# EAGLE design sigma_delta_v1_0 (EAGLE 6.5.0)
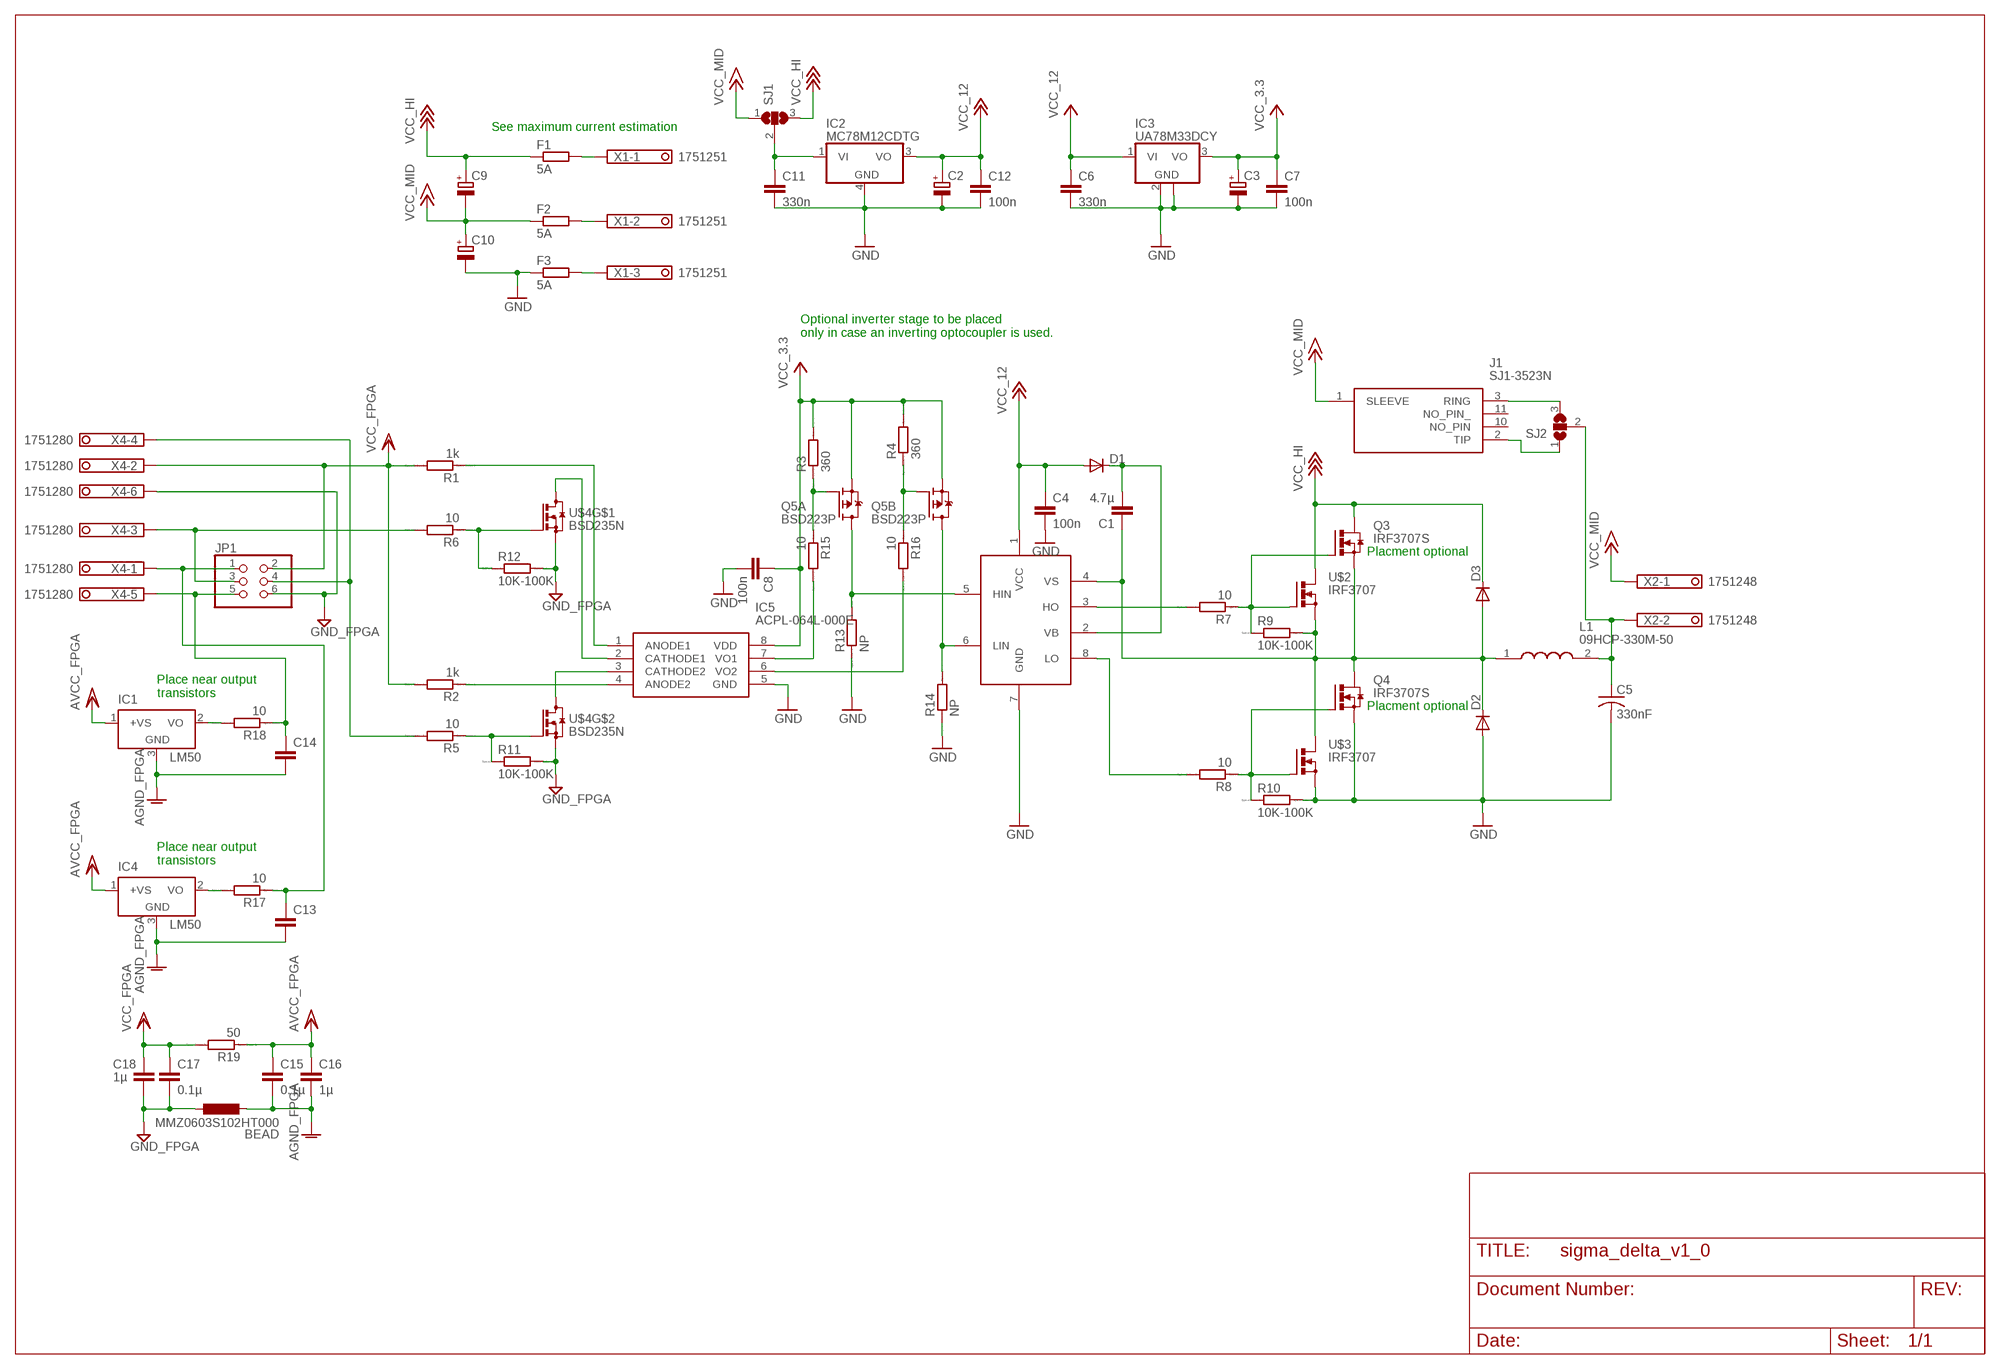
[diagram p0: schematic, sheet 1]

## Parts
BEAD  MMZ0603S102HT000  L-EUL2012C  [L2012C]
C1  4.7µ  C-EUC0805K  [C0805K]
C2  CPOL-EUUD-6,3X7,7  [UD-6,3X7,7_NICHICON]
C3  CPOL-EUUD-6,3X7,7  [UD-6,3X7,7_NICHICON]
C4  100n  C-EUC0805  [C0805]
C5  330nF  C-USC2220K  [C2220K]
C6  330n  C-EUC0603  [C0603]
C7  100n  C-EUC0603  [C0603]
C8  100n  C-EUC0603  [C0603]
C9  CPOL-EUUD-10X10  [UD-10X10_NICHICON]
C10  CPOL-EUUD-10X10  [UD-10X10_NICHICON]
C11  330n  C-EUC0603  [C0603]
C12  100n  C-EUC0603  [C0603]
C13  C-EUC0603  [C0603]
C14  C-EUC0603  [C0603]
C15  0.1µ  C-EUC0603  [C0603]
C16  1µ  C-EUC0603  [C0603]
C17  0.1µ  C-EUC0603  [C0603]
C18  1µ  C-EUC0603  [C0603]
D1  DIODE-DO214AC  [DO214AC]
D2  DIODE-DO214AC  [DO214AC]
D3  DIODE-DO214AC  [DO214AC]
F1  5A  R-EU_M1206  [M1206]
F2  5A  R-EU_M1206  [M1206]
F3  5A  R-EU_M1206  [M1206]
IC1  LM50  [SOT23]
IC2  MC78M12CDTG  [DPACK_3]
IC3  UA78M33DCY  [SOT223]
IC4  LM50  [SOT23]
IC5  ACPL-064L-000E  [SOIC127P599X330-8N]
J1  SJ1-3523N  [SJ13523N]
JP1  PINHD-2X3_2.54  [2X03]
L1  09HCP-330M-50  [09HCP330M50]
Q3  IRF3707S  IRF3704S  [D2PACK]
Q4  IRF3707S  IRF3704S  [D2PACK]
Q5  BSD223P  [SOT363_INFINEON]
R1  1k  RR0603  [R0603]
R2  1k  RR0603  [R0603]
R3  360  RR0603  [R0603]
R4  360  RR0603  [R0603]
R5  10  RR0603  [R0603]
R6  10  RR0603  [R0603]
R7  10  RR0603  [R0603]
R8  10  RR0603  [R0603]
R9  10K-100K  RR0603  [R0603]
R10  10K-100K  RR0603  [R0603]
R11  10K-100K  RR0603  [R0603]
R12  10K-100K  RR0603  [R0603]
R13  NP  RR0603  [R0603]
R14  NP  RR0603  [R0603]
R15  10  RR0603  [R0603]
R16  10  RR0603  [R0603]
R17  10  RR0603  [R0603]
R18  10  RR0603  [R0603]
R19  50  RR0603  [R0603]
SJ1  SJ2W  [SJ_2]
SJ2  SJ2WW  [SJ_2W]
U$1  IR2011  [SO08]
U$2  IRF3707  BUZ11BV  [TO220BV]
U$3  IRF3707  BUZ11BV  [TO220BV]
U$4  BSD235N  [SOT65P210X100-6N]
X1  1751251  [1751251]
X2  1751248  [1751248]
X4  1751280  [1751280]

## Nets
AGND_FPGA [FPGA_Domain]: BEAD.2 C13.2 C14.2 C15.2 C16.2 IC1.3(GND) IC4.3(GND)
AVCC_FPGA [FPGA_Domain]: C15.1 C16.1 IC1.1(+VS) IC4.1(+VS) R19.1
GND: C2.- C3.- C4.2 C5.2 C6.2 C7.2 C8.2 C10.- C11.2 C12.2 D2.A F3.1 IC2.4(GND) IC3.2(GND) IC3.4(GND) IC5.5(GND) Q4.3(S) R10.2 R13.1 R14.1 U$1.7(GND) U$3.S
GND_FPGA: BEAD.1 C17.2 C18.2 JP1.6 R11.2 R12.2 U$4.1(S) U$4.4(S) X4.6
H_BRIDGE_MID: C1.1 D2.C D3.A L1.1 Q3.3(S) Q4.2(D) R9.2 U$1.4(VS) U$2.S U$3.D
N$1: JP1.3 R6.2 X4.3
N$2 [FPGA_Domain]: JP1.4 R5.2 X4.4
N$3: IC5.2(CATHODE1) U$4.6(D)
N$4: IC5.3(CATHODE2) U$4.3(D)
N$5 [FPGA_Domain]: IC5.1(ANODE1) R1.1
N$6 [FPGA_Domain]: IC5.4(ANODE2) R2.1
N$7: Q5.2(A:G) R3.1 R15.1
N$8: IC5.6(VO2) R16.2
N$9: F3.2 X1.3
N$10: C5.1 L1.2 SJ2.2 X2.2
N$11: R5.1 R11.1 U$4.5(G)
N$12: R6.1 R12.1 U$4.2(G)
N$13: R7.2 U$1.3(HO)
N$14: Q3.1(G) R7.1 R9.1 U$2.G
N$15: Q4.1(G) R8.1 R10.1 U$3.G
N$16: R8.2 U$1.8(LO)
N$17: C1.2 D1.C U$1.2(VB)
N$18: F1.2 X1.1
N$19: Q5.6(A:D) R13.2 U$1.5(HIN)
N$20: F2.2 X1.2
N$21: Q5.3(B:D) R14.2 U$1.6(LIN)
N$22: Q5.5(B:G) R4.1 R16.1
N$23: IC4.2(VO) R17.2
N$24: J1.3(RING) SJ2.3
N$25: J1.2(TIP) SJ2.1
N$26: IC5.7(VO1) R15.2
N$27: C11.1 IC2.1(VI) SJ1.2
N$28 [FPGA_Domain]: C13.1 JP1.1 R17.1 X4.1
N$29 [FPGA_Domain]: C14.1 JP1.5 R18.1 X4.5
N$32: IC1.2(VO) R18.2
VCC_3.3: C3.+ C7.1 C8.1 IC3.3(VO) IC5.8(VDD) Q5.1(A:S) Q5.4(B:S) R3.2 R4.2
VCC_12: C2.+ C4.1 C6.1 C12.1 D1.A IC2.3(VO) IC3.1(VI) U$1.1(VCC)
VCC_FPGA [FPGA_Domain]: C17.1 C18.1 JP1.2 R1.2 R2.2 R19.2 X4.2
VCC_HI: C9.+ D3.C F1.1 Q3.2(D) SJ1.3 U$2.D
VCC_MID: C9.- C10.+ F2.1 J1.1(SLEEVE) SJ1.1 X2.1
Unconnected: J1.10(NO_PIN) J1.11(NO_PIN_)

## Notes on the sheet
- See maximum current estimation
- Optional inverter stage to be placed
  only in case an inverting optocoupler is used.
- Placment optional
- Place near output
  transistors
- Placment optional
- Place near output
  transistors

## Library data of the parts
BEAD = rcl:L-EU: INDUCTOR, European symbol
C1 C4 C6-C8 C11-C18 = rcl:C-EU: CAPACITOR, European symbol
C2 C3 C9 C10 = rcl:CPOL-EU: POLARIZED CAPACITOR, European symbol
C5 = rcl:C-US: CAPACITOR, American symbol
D1-D3 = diode:DIODE-: DIODE
F1-F3 = rcl:R-EU_: RESISTOR, European symbol
IC1 IC4 = linear:LM50: SOT-23 Single-Supply Centigrade Temperature Sensor Vout = (10mV/°C x Temp °C) +5mmmV Source: http://cache.national.com/ds/LM/LM50.pdf
IC2 = linear:MC78M: 500 mA Positive Voltage Regulators Source: Data sheet <http://www.onsemi.com/pub_link/Collateral/MC78M00-D.PDF>
IC3 = linear:UA78M*: POSITIVE-VOLTAGE REGULATORS Source: http://focus.ti.com/lit/ds/symlink/ua78m33.pdf
IC5 = SamacSys_Parts:ACPL-064L-000E: Optocoupler Logic-Out Totem-Pole DC-IN 2-CH 8-Pin SO Tube Source: Datasheet <https://componentsearchengine.com/Datasheets/2/ACPL-064L-000E.pdf>; DESCRIPTION: Optocoupler Logic-Out Totem-Pole DC-IN 2-CH 8-Pin SO Tube; HEIGHT: 3.302mm; MANUFACTURER_NAME: Avago Technologies; MANUFACTURER_PART_NUMBER: ACPL-064L-000E; MOUSER_PART_NUMBER: 630-ACPL-064L-000E; MOUSER_PRICE-STOCK: https://www.mouser.co.uk/ProductDetail/Broadcom-Avago/ACPL-064L-000E?qs=wkD9MMxOM1wwSWmQ1LfSEQ%3D%3D
J1 = SamacSys_Parts:SJ1-3523N: Phone Connectors 3.5 MM AUDIO JACK Source: Datasheet <https://componentsearchengine.com/Datasheets/1/SJ1-3523N.pdf>; DESCRIPTION: Phone Connectors 3.5 MM AUDIO JACK; HEIGHT: 5.5mm; MANUFACTURER_NAME: CUI Devices; MANUFACTURER_PART_NUMBER: SJ1-3523N; MOUSER_PART_NUMBER: 490-SJ1-3523N; MOUSER_PRICE-STOCK: https://www.mouser.co.uk/ProductDetail/CUI-Devices/SJ1-3523N?qs=WyjlAZoYn50aNl0vAhb3Tg%3D%3D
JP1 = pinhead:PINHD-2X3: PIN HEADER
L1 = SamacSys_Parts:09HCP-330M-50: Fixed Inductors 33uH 20% RF CHOKE High Current Source: Datasheet <https://www.arrow.com/en/products/09hcp-330m-50/fastron-gmbh>; DESCRIPTION: Fixed Inductors 33uH 20% RF CHOKE High Current; HEIGHT: 10.8mm; MANUFACTURER_NAME: Fastron; MANUFACTURER_PART_NUMBER: 09HCP-330M-50; MOUSER_PART_NUMBER: 434-09HCP-330M; MOUSER_PRICE-STOCK: https://www.mouser.co.uk/ProductDetail/Fastron/09HCP-330M-50?qs=igiTrb5Y5PN4qyNn5ArmZQ%3D%3D
Q3 Q4 = transistor-power:IRF3704: SMPS MOSFET HEXFET® Power MOSFET Source: http://www.irf.com/product-info/datasheets/data/irf3704.pdf
Q5 = transistor-fet:BSD223P: OptiMOS(R)-P Small-Signal-Transistor Dual P-Channel, Enhancement mode, Super Logic Level (2.5 V rated) Source: http://www.infineon.com/upload/Document/BSD223P_Rev1.3.pdf
R1-R19 = eagle-ltspice:R: RESISTOR, European symbol; SPICEMODEL: NONE; SPICEPREFIX: R
SJ1 SJ2 = jumper:SJ2W: SMD solder JUMPER
U$1 = IR2011:IR2011
U$2 U$3 = transistor-power:BUZ11: N-CHANNEL MOS FET
U$4 = SamacSys_Parts:BSD235N
X1 = con-phoenix-350:1751251: MKDS 1/ 3-3,5 Printklemme Nennstrom: 10 A Bemessungsspannung: 160 V Raster: 3,5 mm Polzahl: 3 Montageart: Löten Anschlussart: Schraubanschluss Anschlussrichtung vom Leiter zur Platine: 0° Source: http://eshop.phoenixcontact.com .. 1751251.pdf; OC_FARNELL: unknown; OC_NEWARK: unknown
X2 = con-phoenix-350:1751248: MKDS 1/ 2-3,5 Printklemme Nennstrom: 10 A Bemessungsspannung: 160 V Raster: 3,5 mm Polzahl: 2 Montageart: Löten Anschlussart: Schraubanschluss Anschlussrichtung vom Leiter zur Platine: 0° Source: http://eshop.phoenixcontact.com .. 1751248.pdf; OC_FARNELL: unknown; OC_NEWARK: unknown
X4 = con-phoenix-350:1751280: MKDS 1/ 6-3,5 Printklemme Nennstrom: 10 A Bemessungsspannung: 160 V Raster: 3,5 mm Polzahl: 6 Montageart: Löten Anschlussart: Schraubanschluss Anschlussrichtung vom Leiter zur Platine: 0° Source: http://eshop.phoenixcontact.com .. 1751280.pdf; MPN: 1751280; OC_FARNELL: unknown; OC_NEWARK: 27R1765

## Net classes
0 default: width 0.152 mm, drill 0.305 mm, clearance 0.152 mm
1 FPGA_Domain: width 0.152 mm, drill 0.305 mm, clearance 0.152 mm

## Board
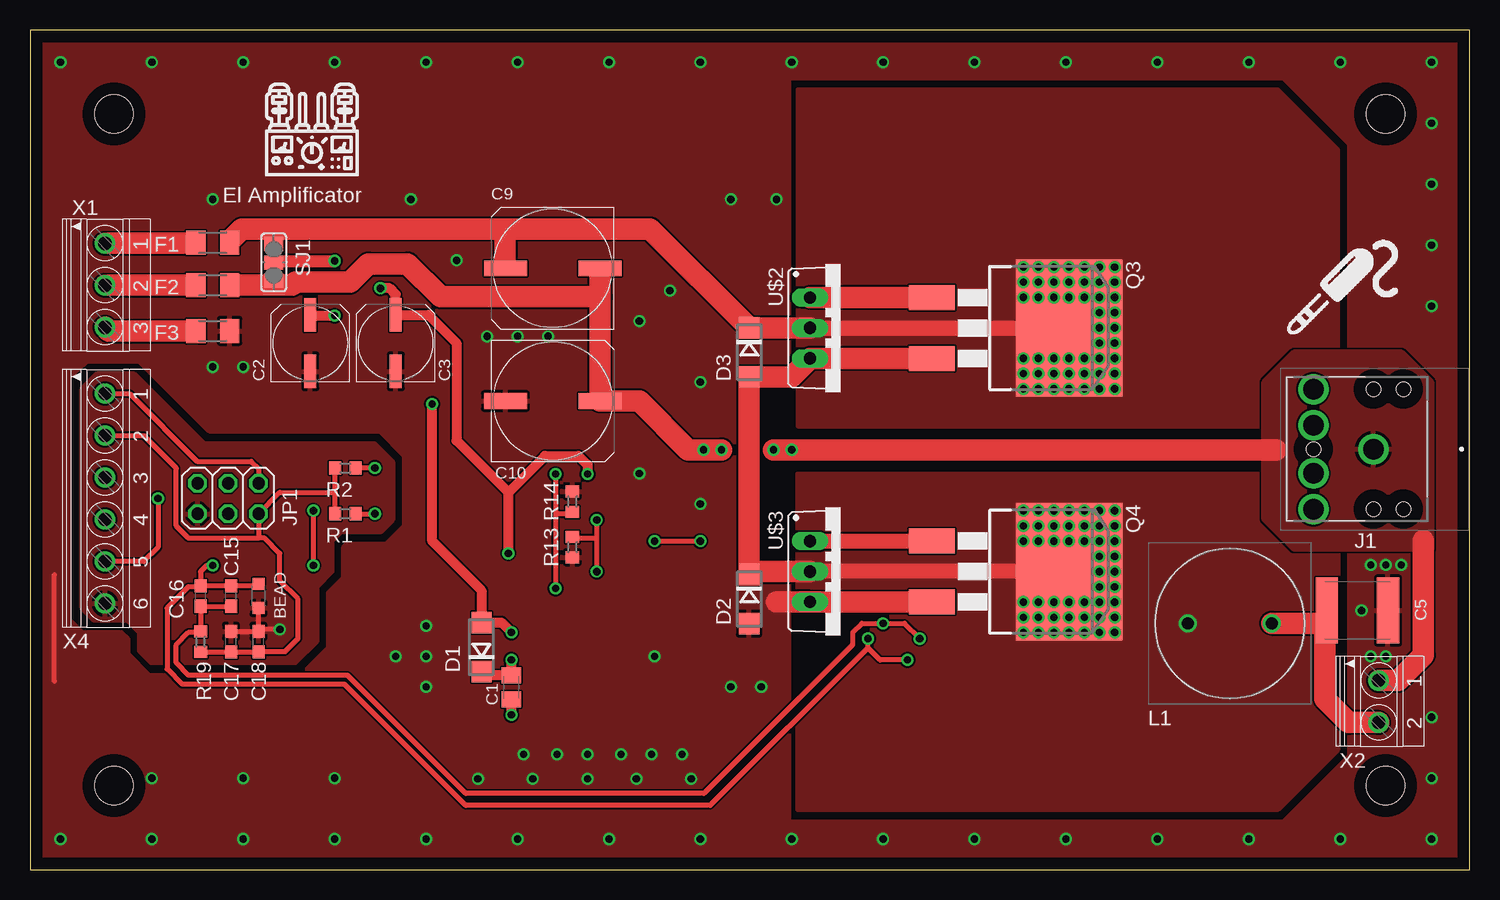
[diagram p1: board, top side]
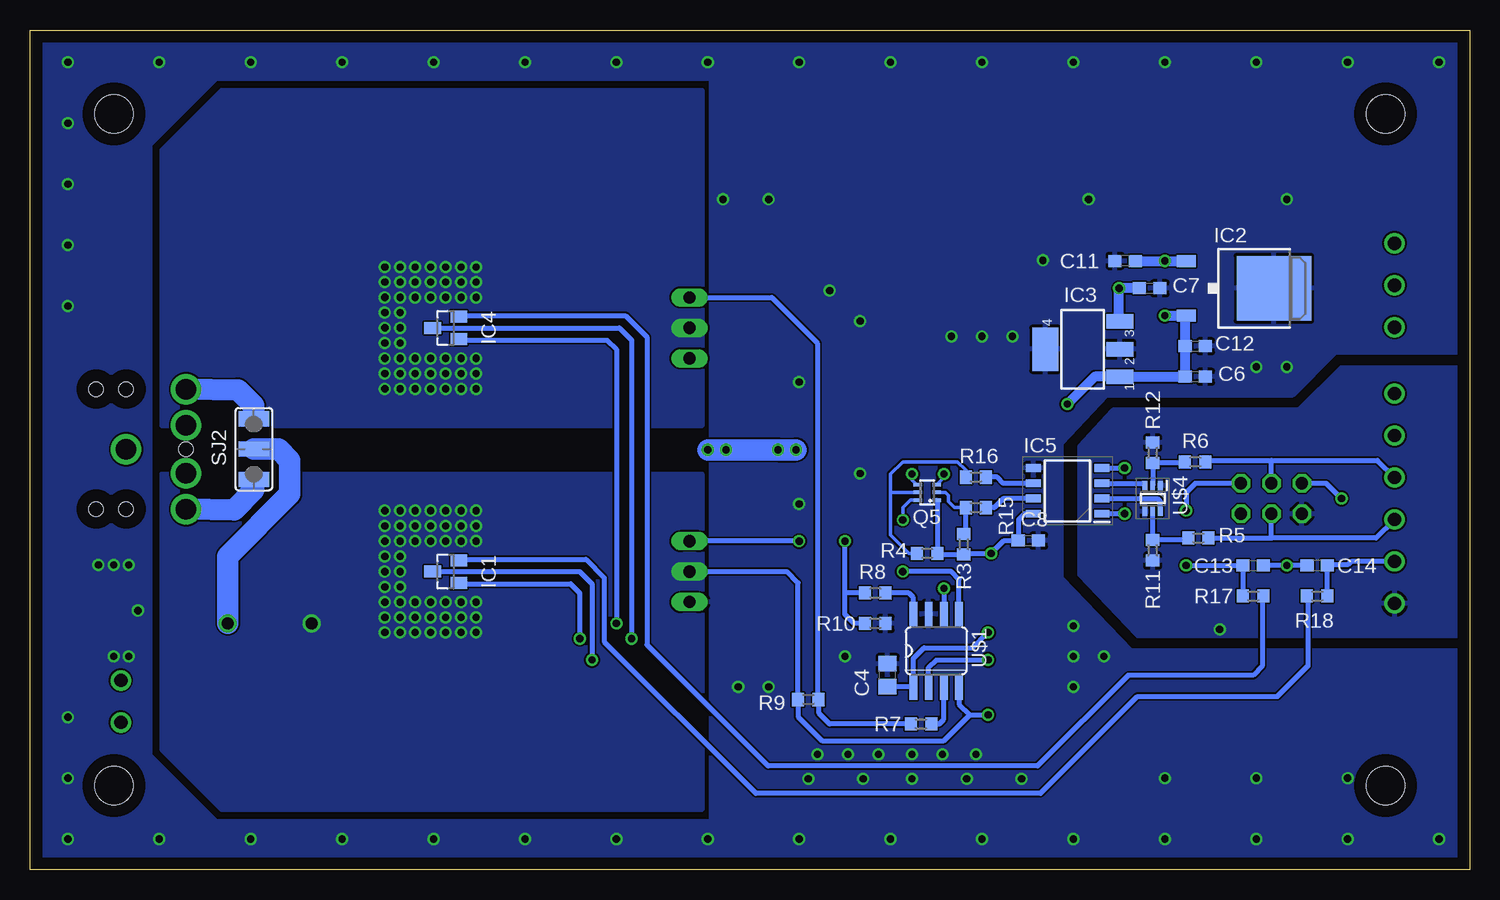
[diagram p2: board, bottom side, seen from below]

Size 120 x 70 mm. Coordinates in mm from the lower left corner, seen from the top.
Outline: 0,0 120,0 120,70 0,70 0,0
Copper layers (1*16): Top 0.035mm / dielectric 1.5mm / Bottom 0.035mm
Design rules "default *": minimum track width 6mil, minimum drill 12mil, track to track 6mil, track to pad 6mil, pad to pad 6mil, via to via 6mil, smd to smd 6mil, copper to edge 40mil, drill to drill 8mil, minimum pad ring 10mil, minimum via ring 8mil, stop-mask expansion 4mil, vias tented up to drill 0mil, thermal gap 10mil
Holes 3.2 mm at 113,63 113,7 7,63 7,7

### Footprints (pad centres in the part's own frame; a part is rotated, then mirrored left to right if it is on the bottom)
L2012C = smd 1 x 1: 1 -1,0; 2 1,0
C0805K = smd 1.3 x 1.6: 1 -1,0; 2 1,0
UD-6,3X7,7_NICHICON = smd 2.8 x 1: + 2.35,0; - -2.35,0
C0805 = smd 1.3 x 1.5: 1 -0.95,0; 2 0.95,0
C2220K = smd 1.85 x 5.5: 1 -2.55,0; 2 2.55,0
C0603 = smd 1.1 x 1: 1 -0.85,0; 2 0.85,0
UD-10X10_NICHICON = smd 3.6 x 1.3: + 3.925,0; - -3.95,0
DO214AC = smd 1.8 x 1.7: A 2.05,0; C -2.05,0
M1206 = smd 1.6 x 2: 1 -1.4,0; 2 1.4,0
SOT23 = smd 1 x 1.4: 1 -0.95,-1.1; 2 0.95,-1.1; 3 0,1.1
DPACK_3 = smd 1 x 1.6: 1 -2.28,-4.8; 3 2.28,-4.8 | smd 5.4 x 6.2: 4 0,2.5
SOT223 = smd 1.219 x 2.235: 1 -2.311,-3.099; 2 0,-3.099; 3 2.311,-3.099 | smd 3.6 x 2.2: 4 0,3.099
SOIC127P599X330-8N = smd 1.25 x 0.65: 1 -2.85,1.905; 2 -2.85,0.635; 3 -2.85,-0.635; 4 -2.85,-1.905; 5 2.85,-1.905; 6 2.85,-0.635; 7 2.85,0.635; 8 2.85,1.905
SJ13523N = drill 1.7 pad 2.55: 1 4.5,0; 2 9.5,-5; 3 9.5,5 | drill 1.7 pad 2.4: 10 9.5,-2; 11 9.5,2 | hole 1.2: 2,5; 4.5,5; 9.5,0; 2,-5; 4.5,-5
2X03 = drill 1.016 octagon: 1 -2.54,-1.27; 2 -2.54,1.27; 3 0,-1.27; 4 0,1.27; 5 2.54,-1.27; 6 2.54,1.27
09HCP330M50 = drill 1 pad 1.5: 1 0,0; 2 7,0
D2PACK = smd 2.083 x 3.81: 1 -2.54,-8.89; 3 2.54,-8.89 | smd 11.43 x 8.89: 2 0,2.54
SOT363_INFINEON = smd 0.3 x 0.7: 1 -0.65,-0.8; 2 0,-0.8; 3 0.65,-0.8; 4 0.65,0.8; 5 0,0.8; 6 -0.65,0.8
R0603 = smd 1 x 1.1: 1 -0.85,0; 2 0.85,0
SJ_2 = smd 1.168 x 1.6: 1 -1.524,0; 2 0,0; 3 1.524,0
SJ_2W = smd 1.27 x 2.54: 1 -2.54,0; 2 0,0; 3 2.54,0
SO08 = smd 0.66 x 2.032: 1 -1.905,-3.073; 2 -0.635,-3.073; 3 0.635,-3.073; 4 1.905,-3.073; 5 1.905,3.073; 6 0.635,3.073; 7 -0.635,3.073; 8 -1.905,3.073
TO220BV = drill 1.016 long: D 0,-2.54; G -2.54,-2.54; S 2.54,-2.54
SOT65P210X100-6N = smd 0.75 x 0.4: 1 -1.1,0.65; 2 -1.1,0; 3 -1.1,-0.65; 4 1.1,-0.65; 5 1.1,0; 6 1.1,0.65
1751251 = drill 1.1 pad 1.7: 1 -3.5,-0.1; 2 0,-0.1; 3 3.5,-0.1
1751248 = drill 1.1 pad 1.7: 1 -1.75,-0.1; 2 1.75,-0.1
1751280 = drill 1.1 pad 1.7: 1 -8.75,-0.1; 2 -5.25,-0.1; 3 -1.75,-0.1; 4 1.75,-0.1; 5 5.25,-0.1; 6 8.75,-0.1

### Placement (x,y rotation side)
BEAD  19.05,22.81 90 top
C1  40.13,15.19 90 top
C2  23.37,43.89 90 top
C3  30.48,43.89 90 top
C4  48.51,16.2 90 bottom
C5  110.65,21.6 0 top
C6  22.86,41.1 0 bottom
C7  26.67,48.46 0 bottom
C8  36.78,27.43 0 bottom
C9  43.56,50.14 180 top
C10  43.59,39.06 0 top
C11  28.7,50.75 180 bottom
C12  22.86,43.64 0 bottom
C13  18.03,25.35 0 bottom
C14  12.7,25.35 180 bottom
C15  16.76,22.81 90 top
C16  14.22,22.81 90 top
C17  16.76,19 90 top
C18  19.05,19 90 top
D1  37.64,18.54 90 top
D2  59.94,22.55 270 top
D3  59.94,43.13 270 top
F1  15.24,52.27 180 top
F2  15.24,48.72 180 top
F3  15.24,44.91 180 top
IC1  85.34,24.84 90 bottom
IC2  18.8,48.46 270 bottom
IC3  32.26,43.38 90 bottom
IC4  85.34,45.16 90 bottom
IC5  33.5,31.57 180 bottom
J1  116.48,35.05 180 top
JP1  16.51,30.94 180 top
L1  96.52,20.52 0 top
Q3  84.07,45.16 270 top
Q4  84.07,24.84 270 top
Q5  45.21,31.44 90 bottom
R1  26.29,29.67 180 top
R2  26.29,33.48 180 top
R3  42.16,27.13 270 bottom
R4  45.21,26.36 0 bottom
R5  22.61,27.63 0 bottom
R6  22.86,33.98 0 bottom
R7  45.72,12.14 0 bottom
R8  49.53,23.06 0 bottom
R9  55.12,14.17 180 bottom
R10  49.53,20.52 0 bottom
R11  26.42,26.62 270 bottom
R12  26.42,34.75 90 bottom
R13  45.21,26.87 90 top
R14  45.21,30.68 270 top
R15  41.15,30.17 0 bottom
R16  41.15,32.71 0 bottom
R17  18.03,22.81 0 bottom
R18  12.7,22.81 180 bottom
R19  14.22,19 270 top
SJ1  20.32,50.62 90 top
SJ2  101.35,35.05 270 bottom
U$1  44.45,18.24 0 bottom
U$2  67.56,45.16 270 top
U$3  67.56,24.84 270 top
U$4  26.42,30.94 270 bottom
X1  6.35,48.72 270 top
X2  112.52,14.01 270 top
X4  6.35,30.94 270 top

### Tracks (layer width: path | path; a pad name or v marks a point on that pad's centre or on a via)
AGND_FPGA  (via drill 0.6)
  Top 0.406: BEAD.2 18.9,23.66 C15.2 C16.2 | v15.24,25.35 14.73,25.35 14.22,24.84 C16.2 | C16.2 14.14,23.57 13.21,23.57 11.43,21.79 11.43,16.71 12.7,15.44 26.21,15.44 36.32,5.33 56.69,5.33 69.85,18.49 | v73.15,17.47 70.87,17.47 69.85,18.49 | 69.85,18.49 v69.85,19.25
  Bottom 0.406: IC4.3 70.87,45.16 69.85,44.14 v69.85,19.25 | C14.2 v15.24,25.35 C13.2 | IC1.3 74.17,24.84 73.15,23.82 v73.15,17.47
AVCC_FPGA  (via drill 0.6)
  Top 0.406: C15.1 C16.1 R19.1 14.14,19.76 13.21,19.76 12.19,18.74 12.19,17.22 13.21,16.2 26.47,16.2 36.32,6.35 56.19,6.35 68.58,18.74 68.58,19.76 69.34,20.52 v71.12,20.52 72.9,20.52 v74.17,19.25
  Bottom 0.406: IC4.1 84.18,44.14 71.88,44.14 71.12,43.38 v71.12,20.52 | IC1.1 84.18,23.82 74.93,23.82 74.17,23.06 v74.17,19.25
GND  (via drill 0.6, 0.6 pad 0.3)
  Top 0.406: 2.03,15.7 2.03,24.59
  Top 1.778: 62.23,22.3 U$3.S Q4.3
  other vias: 37.34,7.57 46.48,7.57 55.12,7.57 25.4,7.62 17.78,7.62 10.16,7.62 58.42,15.24 60.96,15.24 55.88,30.48 55.88,40.64 50.8,33.02 50.8,45.72 52.07,17.78 30.48,17.78 17.78,41.91 15.24,41.91 15.24,55.88 31.75,55.88 53.34,48.26 62.23,55.88 58.42,55.88 71.12,67.31 78.74,67.31 86.36,67.31 93.98,67.31 101.6,67.31 109.22,67.31 116.84,67.31 63.5,67.31 71.12,2.54 78.74,2.54 86.36,2.54 93.98,2.54 101.6,2.54 109.22,2.54 116.84,2.54 63.5,2.54 10.16,67.31 17.78,67.31 25.4,67.31 33.02,67.31 40.64,67.31 48.26,67.31 55.88,67.31 2.54,67.31 10.16,2.54 17.78,2.54 25.4,2.54 33.02,2.54 40.64,2.54 48.26,2.54 55.88,2.54 2.54,2.54 113.03,25.4 114.3,25.4 111,21.59 111.76,25.4 111.76,17.78 113.03,17.78 38.1,44.45 40.64,44.45 43.18,44.45 35.56,50.8 46.48,9.6 49.28,9.6 51.82,9.6 54.36,9.6 43.94,9.6 41.15,9.6 41.91,7.57 50.55,7.57 33.02,17.78 33.02,20.32 33.02,15.24 116.84,62.23 116.84,57.15 116.84,52.07 116.84,46.99 116.84,12.7 116.84,7.62
  pour Top (rank 2): 0.51,69.55 63.23,69.55 63.23,0.51 0.51,0.51 0.51,19.76 7.62,19.76 8.13,19.25 8.13,17.98 9.91,16.2 22.61,16.2 24.89,18.49 24.89,23.06 26.16,24.33 26.16,26.87 26.42,27.13 29.72,27.13 31.24,28.65 31.24,34.49 29.21,36.52 14.99,36.52 9.14,42.37 0.51,42.37
  pour Bottom: 0.51,69.55 63.23,69.55 63.23,-0.49 0.51,0.51 0.51,18.24 28.19,18.24 34.04,24.33 34.04,35.51 30.23,39.57 14.73,39.57 11.18,43.13 0.51,43.13
  pour Top (rank 2): 0.51,44.4 0.51,17.73 5.59,17.73 5.59,18.49 3.3,20.78 3.3,41.1 5.84,43.38 5.84,44.4
  pour Top (rank 6): 61,1 61,4 104.5,4 110,9.5 110,60.5 104.5,66 61,66 61,69 119,69 119,1
  pour Bottom: 61,1 61,4 104.5,4 110,9.5 110,60.5 104.5,66 61,66 61,69 119,69 119,1
GND_FPGA  (via drill 0.6)
  Top 0.406: C17.2 C18.2 | C18.2 BEAD.1 | v20.83,20.01 19.22,20.01 C18.2
  pour Bottom: 0.51,41.86 10.69,41.83 14.22,38.3 29.72,38.3 32.51,35.25 32.51,24.59 27.69,19.51 0.51,19.51
  pour Top: 14.48,35.51 28.7,35.51 30.23,33.98 30.23,29.16 29.21,28.14 25.91,28.14 25.15,27.38 25.15,24.84 23.88,23.57 23.88,19 22.1,17.22 10.16,17.22 9.14,18.24 9.14,19.76 8.13,20.78 5.33,20.78 4.32,21.79 4.32,40.08 5.59,41.35 8.64,41.35
H_BRIDGE_MID  (via drill 0.6)
  Top 0.813: v40.13,12.9 C1.1
  Top 1.27: Q4.2 U$3.D | D2.C 60.18,24.84
  Top 1.778: Q3.3 U$2.S 63.48,41.08 D3.A D2.C | 60.18,24.84 U$3.D
  Bottom 0.406: U$1.4 42.55,13.79 41.66,12.9 | 41.66,12.9 v40.13,12.9 | U$3.D 56.9,24.84 55.97,23.91 R9.2 55.97,12.74 53.98,10.74 43.81,10.74 41.66,12.9
  other vias: 82.8,29.92 84.07,29.92 85.34,29.92 86.61,29.92 87.88,29.92 89.15,29.92 90.42,29.92 82.8,28.65 84.07,28.65 85.34,28.65 86.61,28.65 87.88,28.65 89.15,28.65 90.42,28.65 82.8,27.38 84.07,27.38 85.34,27.38 86.61,27.38 87.88,27.38 89.15,27.38 90.42,27.38 89.15,26.11 90.42,26.11 89.15,24.84 90.42,24.84 89.15,23.57 90.42,23.57 82.8,22.3 84.07,22.3 85.34,22.3 86.61,22.3 87.88,22.3 89.15,22.3 90.42,22.3 82.8,21.03 84.07,21.03 85.34,21.03 86.61,21.03 87.88,21.03 89.15,21.03 90.42,21.03 82.8,19.76 84.07,19.76 85.34,19.76 86.61,19.76 87.88,19.76 89.15,19.76 90.42,19.76
  pour Top (rank 6, no thermals): 64,33 109,33 109,10 104,5 64,5
  pour Bottom (no thermals): 64,33 64,5 104,5 109,10 109,33
N$1
  Bottom 0.406: JP1.3 16.51,34.11 | 16.51,34.11 7.67,34.11 X4.3 | R6.2 21.88,34.11 16.51,34.11
N$2
  Bottom 0.406: 16.51,27.63 JP1.4 | 16.51,27.63 7.8,27.63 X4.4 | R5.2 16.51,27.63
N$3
  Bottom 0.406: U$4.6 25.77,30.67 26.04,30.94 IC5.2
N$4
  Bottom 0.406: 27.07,32.08 U$4.3 27.24,32.21 IC5.3
N$5  (via drill 0.6)
  Top 0.406: R1.1 v28.75,29.67
  Bottom 0.406: v28.75,29.67 IC5.1
N$6  (via drill 0.6)
  Top 0.406: v28.75,33.48 R2.1
  Bottom 0.406: IC5.4 v28.75,33.48
N$7
  Bottom 0.305: Q5.2 43.69,31.44 43.43,31.19 43.43,30.68 42.93,30.17 R15.1
  Bottom 0.406: R3.1 42,28.14 R15.1
N$8
  Bottom 0.406: IC5.6 38.86,32.21 39.37,32.71 R16.2
N$9
  Top 1.422: 13.08,44.91 F3.2
  Top 1.778: X1.3 6.56,44.91 13.08,44.91
N$10
  Top 0.813: 107.9,20.52 107.95,20.57 108.2,20.83 108.2,21.5 C5.1
  Top 1.778: L1.2 107.9,20.52 | X2.2 109.91,12.26 107.95,14.22 107.95,20.57
  Bottom 1.778: SJ2.2 99.29,35.05 98.35,34.11 98.35,31.29 103.52,26.12 L1.2
N$11
  Bottom 0.406: R5.1 23.62,27.47 R11.1 U$4.5
N$12
  Bottom 0.406: R6.1 23.8,33.9 R12.1 U$4.2
N$13
  Bottom 0.406: R7.2 44.2,12.14 43.81,12.52 U$1.3
N$14
  Top 1.778: Q3.1 U$2.G
  Bottom 0.406: R7.1 53.34,12.14 54.27,13.07 R9.1 54.27,14.59 54.36,14.68 54.36,43.89 58.17,47.7 U$2.G
N$15  (via drill 0.6)
  Top 0.406: v52.07,27.38 v55.88,27.38
  Top 1.27: U$3.G Q4.1
  Bottom 0.406: R10.1 51.31,20.52 52.07,21.28 52.07,23.06 | 52.07,23.06 v52.07,27.38 | R8.1 52.07,23.06 | v55.88,27.38 U$3.G
N$16
  Bottom 0.406: U$1.8 46.35,22.68 46.74,23.06 R8.2
N$17  (via drill 0.6)
  Top 0.813: v40.13,17.47 C1.2 37.95,16.19 D1.C
  Bottom 0.406: U$1.2 45.09,16.84 44.45,17.47 v40.13,17.47
N$18
  Top 1.422: 13.13,52.22 13.84,52.22 F1.2
  Top 1.778: X1.1 13.13,52.22
N$19  (via drill 0.6)
  Top 0.305: 45.3,27.63 R13.2
  Top 0.406: 45.3,27.63 47.24,27.63 | v47.24,29.16 47.24,27.63 | 47.24,27.63 v47.24,24.84
  Bottom 0.305: Q5.6 46.62,30.79 47.24,30.17 v47.24,29.16
  Bottom 0.406: U$1.5 42.55,24.2 43.18,24.84 v47.24,24.84
N$20
  Top 1.016: 13.31,48.69 13.84,48.69
  Top 1.422: 13.84,48.69 F2.2
  Top 1.778: X1.2 13.31,48.72 13.31,48.69
N$21  (via drill 0.6)
  Top 0.406: 45.12,29.92 R14.2 45.05,29.67 43.81,29.67 | v43.81,32.97 43.81,29.67 | 43.81,29.67 v43.81,23.44
  Bottom 0.305: Q5.3 43.81,32.69 v43.81,32.97
  Bottom 0.406: v43.81,23.44 U$1.6
N$22
  Bottom 0.305: R16.1 42,33.31 42.67,33.98 47.24,33.98 48.26,32.97 48.26,31.44 | 48.26,31.44 Q5.5 | R4.1 46.74,26.36 48.26,27.89 48.26,31.44
N$23
  Bottom 0.406: IC4.2 84.18,46.18 70.36,46.18 68.58,44.4 68.58,18.74 58.47,8.64 36.02,8.64 28.45,16.2 18.03,16.2 17.27,16.97 17.27,22.72 R17.2
N$24
  Bottom 0.406: 101.35,31.98 SJ2.3
  Bottom 1.778: J1.3 102.99,30 101.35,31.65 101.35,31.98
N$25
  Bottom 0.406: 101.35,38.18 SJ2.1
  Bottom 1.778: J1.2 102.66,40 101.35,38.68 101.35,38.18
N$26
  Bottom 0.406: IC5.7 38.86,30.94 39.62,30.17 R15.2
N$27  (via drill 0.6)
  Top 0.813: SJ1.2 20.45,50.75
  Top 1.016: 20.45,50.75 v25.4,50.75
  Bottom 0.813: C11.1 v25.4,50.75 IC2.1
N$28  (via drill 0.6)
  Top 0.406: X4.1 8.29,39.69 13.95,34.03 18.44,34.03 19.05,33.42 JP1.1 | v23.62,29.92 v23.62,25.35
  Bottom 0.406: JP1.1 22.86,32.21 23.62,31.44 v23.62,29.92 | v23.62,25.35 C13.1 R17.1
N$29  (via drill 0.6)
  Top 0.406: v10.67,30.94 10.67,26.87 9.48,25.69 X4.5
  Bottom 0.406: v10.67,30.94 11.94,32.21 JP1.5 | R18.1 C14.1 11.8,25.4 10.16,25.4 9.87,25.69 X4.5
N$32
  Bottom 0.406: R18.2 13.46,22.72 13.46,16.97 16,14.43 27.69,14.43 35.76,6.35 59.49,6.35 60,6.86 60.1,6.96 72.14,19 72.14,24.33 73.66,25.86 84.18,25.86 IC1.2
VCC_3.3  (via drill 0.6, 0.6 pad 0.3)
  Top 0.813: 30.48,47.19 C3.+ | 39.88,31.44 35.56,35.76 35.56,43.89 33.21,46.24 C3.+ | 39.88,31.44 42.93,34.49 45.72,34.49 46.48,33.73 v46.48,32.97 | v39.88,26.36 39.88,31.44 | C3.+ 30.48,47.95 29.97,48.46 v29.21,48.46
  Bottom 0.305: Q5.4 46.12,32.09 46.48,32.46 v46.48,32.97
  Bottom 0.406: R3.2 42.08,26.36 v39.88,26.36 38.81,27.43 C8.1 37.59,27.47 37.59,29.16 37.08,29.67 IC5.8 | R3.2 42.33,26.11 | R3.2 44.27,26.28 R4.2 44.36,30.74 Q5.1
  Bottom 0.813: C7.1 v29.21,48.46 29.21,45.74 IC3.3
VCC_12  (via drill 0.6, 0.6 pad 0.3)
  Top 0.813: C2.+ 23.43,46.18 v25.4,46.18 | v33.53,38.81 33.53,27.38 37.64,23.26 D1.A 39.3,20.59 v40.13,19.76
  Bottom 0.406: v40.13,19.76 41.4,18.49 45.47,18.49 46.35,17.6 U$1.1 46.45,15.25 C4.1
  Bottom 0.813: v25.4,46.18 v25.39,46.18 IC2.3 23.71,46.07 C12.1 C6.1 23.73,41.07 IC3.1 29.18,41.1 31.24,41.1 v33.53,38.81
VCC_FPGA
  Top 0.406: R1.2 25.44,31.44 | 25.44,31.44 R2.2 | 19.05,27.63 13.21,27.63 12.19,28.65 12.19,33.48 9.48,36.19 X4.2 | 25.44,31.44 20.83,31.44 JP1.2 19.05,27.63 | R19.2 C17.1 C18.1 21.25,18.15 22.35,19.25 22.35,22.55 20.83,24.08 20.83,26.36 19.56,27.63 19.05,27.63
VCC_HI  (via drill 0.6)
  Top 0.406: SJ1.3 20.32,53.37 20.37,53.42 | 39.62,50.8 39.62,50.15 C9.+
  Top 1.27: U$2.D Q3.2 | 59.96,45.16 arc-90 D3.C
  Top 1.422: 16.94,52.7 16.94,52.57 F1.1
  Top 1.778: U$2.D 59.96,45.16 | D3.C 51.71,53.42 39.7,53.42 | 39.7,53.42 20.37,53.42 17.65,53.42 16.94,52.7 | 39.7,53.42 39.62,53.34 39.62,50.8
  other vias: 82.8,50.24 84.07,50.24 85.34,50.24 86.61,50.24 87.88,50.24 89.15,50.24 90.42,50.24 82.8,48.97 84.07,48.97 85.34,48.97 86.61,48.97 87.88,48.97 89.15,48.97 90.42,48.97 82.8,47.7 84.07,47.7 85.34,47.7 86.61,47.7 87.88,47.7 89.15,47.7 90.42,47.7 82.8,42.62 84.07,42.62 85.34,42.62 86.61,42.62 87.88,42.62 89.15,42.62 90.42,42.62 82.8,41.35 84.07,41.35 85.34,41.35 86.61,41.35 87.88,41.35 89.15,41.35 90.42,41.35 82.8,40.08 84.07,40.08 85.34,40.08 86.61,40.08 87.88,40.08 89.15,40.08 90.42,40.08 89.15,46.43 90.42,46.43 89.15,45.16 90.42,45.16 89.15,43.89 90.42,43.89
  pour Top (rank 6, no thermals): 64,37 109,37 109,60 104,65 64,65
  pour Bottom (no thermals): 64,37 109,37 109,60 104,65 64,65
VCC_MID  (via drill 0.6 pad 0.3)
  Top 0.406: C10.+ 47.52,39.08 47.52,39.7 | C9.- 47.52,50.13 47.52,49.48 | SJ1.1 20.42,48.99 20.42,48.72
  Top 1.016: C9.-
  Top 1.422: F2.1 17.42,48.72
  Top 1.778: C10.+ 50.8,39.06 54.86,35 v57.66,35 | v61.98,35 v63.5,35 103.89,35 | 17.42,48.72 20.42,48.72 21.84,48.72 22.1,48.97 26.67,48.97 28.19,50.49 31.5,50.49 34.24,47.75 47.52,47.75 | 47.52,47.75 47.52,49.48 | 47.52,39.7 47.52,47.75 | X2.1 114.06,15.76 116.15,17.86 116.15,27.43
  Bottom 1.778: v56.13,35 v57.66,35 v63.5,35
  pour Top: 105.41,43.18 114.3,43.18 116.84,40.64 116.84,26.67 105.41,26.67 102.87,29.21 102.87,40.64

### Text on the board
tNames: El Amplificator